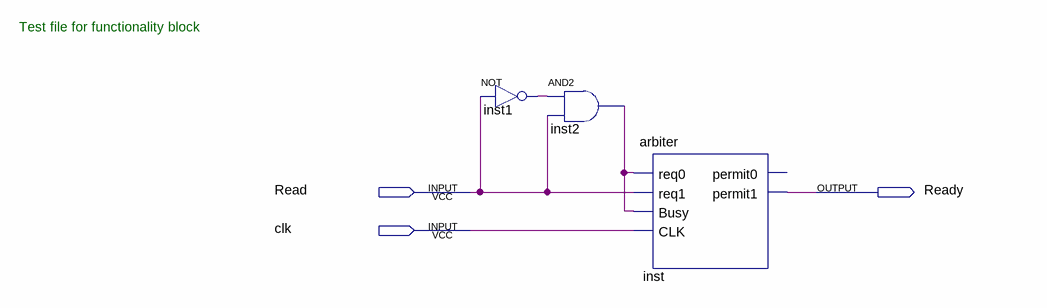
[diagram p0: schematic sheet]
// Quartus schematic Test.bdf as structural Verilog: 3 symbols, 3 pins
module Test (
  input  Read,
  input  clk,
  output Ready
);

  wire inst1_out, inst2_out;

  not inst1 (inst1_out, Read);
  and inst2 (inst2_out, inst1_out, Read);
  arbiter inst (.req0(inst2_out), .req1(Read), .Busy(inst2_out), .CLK(clk), .permit1(Ready));  // open: permit0

  // Notes on the sheet:
  //   Test file for functionality block
endmodule
